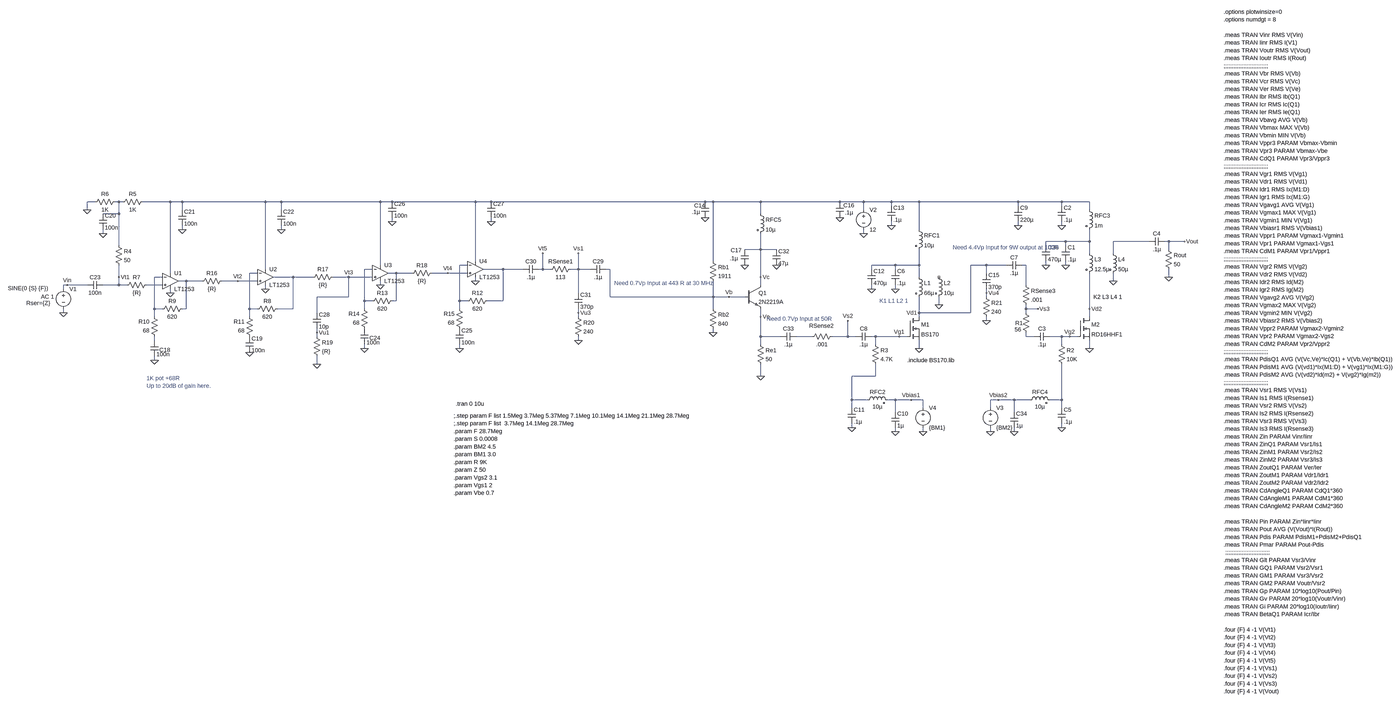
[diagram p0: schematic LT1253 2N2219 CC BS170 RD16HHF Power Amp Testing.asc, whole sheet]
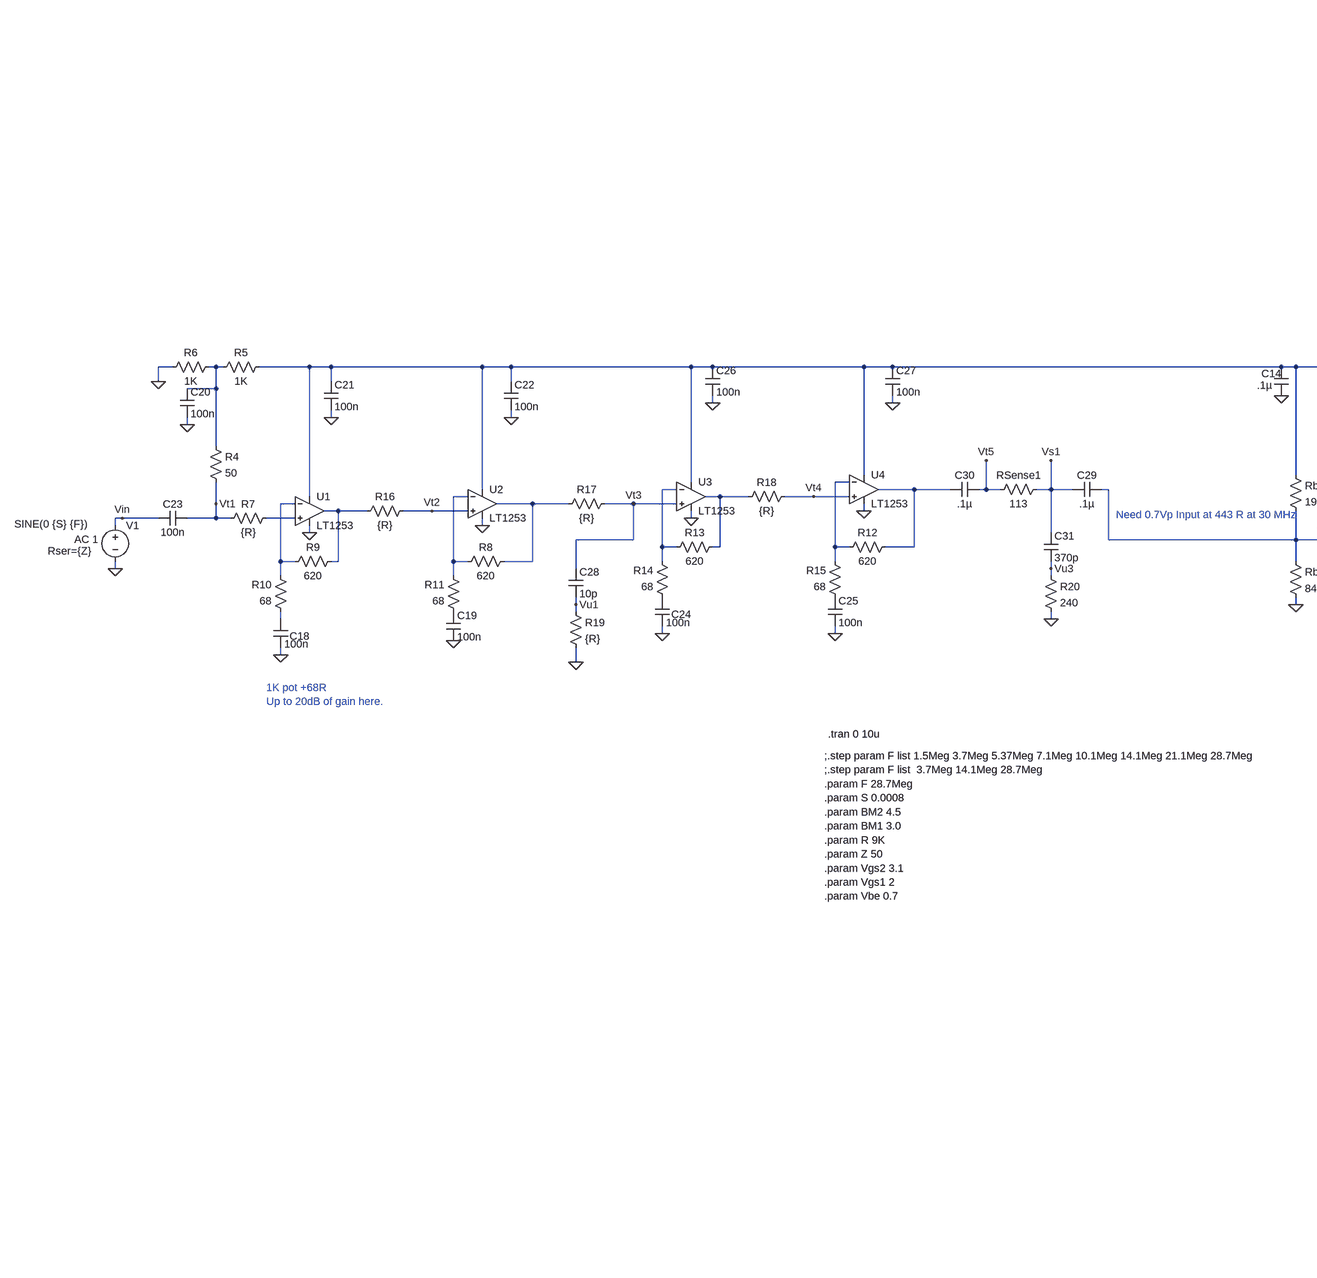
[diagram p1: schematic LT1253 2N2219 CC BS170 RD16HHF Power Amp Testing.asc, part, row 1 of 1, column 1 of 2]
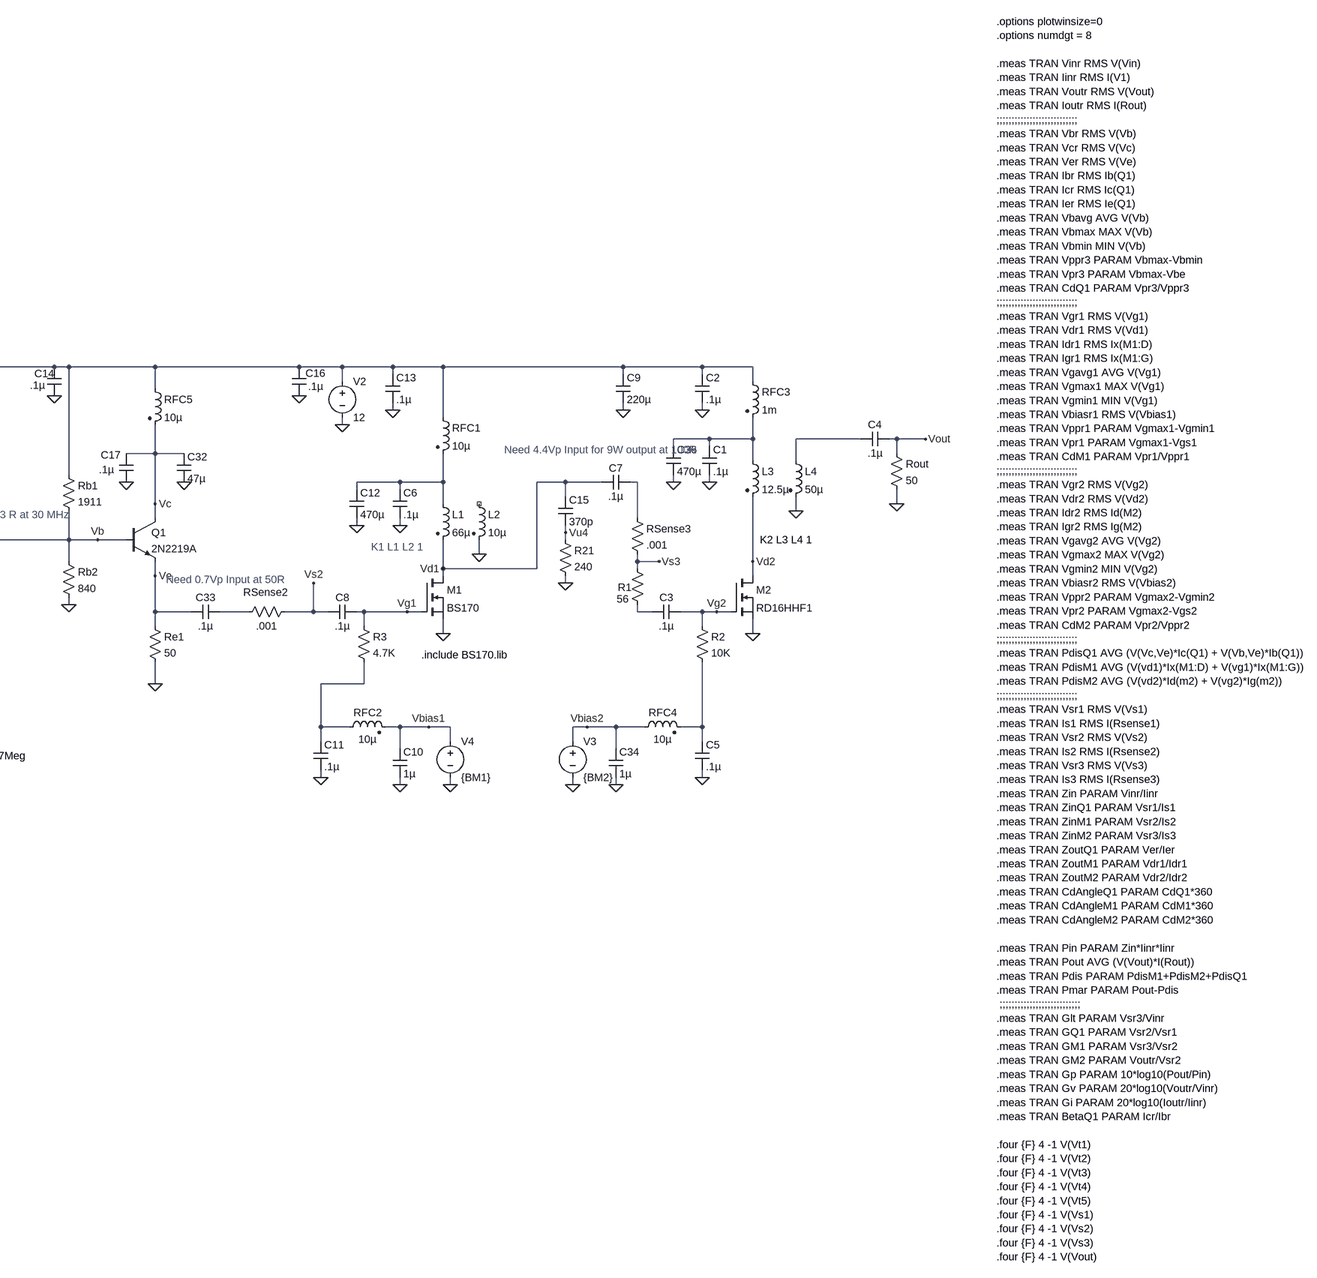
[diagram p2: schematic LT1253 2N2219 CC BS170 RD16HHF Power Amp Testing.asc, part, row 1 of 1, column 2 of 2]
LT1253 2N2219 CC BS170 RD16HHF Power Amp Testing.asc, the LTspice schematic file:
Version 4
SHEET 1 3136 1620
WIRE -2864 -176 -2896 -176
WIRE -2768 -176 -2784 -176
WIRE -2752 -176 -2768 -176
WIRE -2560 -176 -2672 -176
WIRE -2512 -176 -2560 -176
WIRE -2176 -176 -2512 -176
WIRE -2112 -176 -2176 -176
WIRE -1712 -176 -2112 -176
WIRE -1664 -176 -1712 -176
WIRE -1328 -176 -1664 -176
WIRE -1264 -176 -1328 -176
WIRE -400 -176 -1264 -176
WIRE -368 -176 -400 -176
WIRE -176 -176 -368 -176
WIRE 144 -176 -176 -176
WIRE 240 -176 144 -176
WIRE 352 -176 240 -176
WIRE 464 -176 352 -176
WIRE 864 -176 464 -176
WIRE 1040 -176 864 -176
WIRE 1152 -176 1040 -176
WIRE 352 -160 352 -176
WIRE 864 -160 864 -176
WIRE 1040 -160 1040 -176
WIRE -2896 -144 -2896 -176
WIRE -2512 -144 -2512 -176
WIRE -2112 -144 -2112 -176
WIRE 240 -144 240 -176
WIRE 1152 -144 1152 -176
WIRE -2768 -128 -2768 -176
WIRE -2768 -128 -2832 -128
WIRE -176 -128 -176 -176
WIRE -1664 -96 -1664 -112
WIRE -1264 -96 -1264 -112
WIRE 352 -80 352 -96
WIRE 864 -80 864 -96
WIRE 1040 -80 1040 -96
WIRE -2512 -64 -2512 -80
WIRE -2112 -64 -2112 -80
WIRE 464 -64 464 -176
WIRE -2832 -48 -2832 -64
WIRE 240 -48 240 -64
WIRE 1056 -16 976 -16
WIRE 1152 -16 1152 -64
WIRE 1152 -16 1056 -16
WIRE 1392 -16 1248 -16
WIRE 1472 -16 1456 -16
WIRE 1536 -16 1472 -16
WIRE -2768 0 -2768 -128
WIRE 976 0 976 -16
WIRE 1056 0 1056 -16
WIRE -176 16 -176 -48
WIRE -176 16 -240 16
WIRE -112 16 -176 16
WIRE 1472 16 1472 -16
WIRE 1152 32 1152 -16
WIRE 1248 32 1248 -16
WIRE -1328 64 -1328 -176
WIRE -368 64 -368 -176
WIRE -1712 80 -1712 -176
WIRE -1360 80 -1392 80
WIRE 368 80 272 80
WIRE 464 80 464 16
WIRE 464 80 368 80
WIRE 736 80 672 80
WIRE 816 80 736 80
WIRE 896 80 880 80
WIRE 976 80 976 64
WIRE 1056 80 1056 64
WIRE -2176 96 -2176 -176
WIRE -1744 96 -1776 96
WIRE -1216 96 -1296 96
WIRE -1136 96 -1216 96
WIRE -1056 96 -1056 32
WIRE -1056 96 -1072 96
WIRE -1024 96 -1056 96
WIRE -912 96 -912 32
WIRE -912 96 -944 96
WIRE -864 96 -912 96
WIRE -784 96 -800 96
WIRE 272 96 272 80
WIRE 368 96 368 80
WIRE -2560 112 -2560 -176
WIRE -2208 112 -2240 112
WIRE -1648 112 -1680 112
WIRE -1584 112 -1648 112
WIRE -1440 112 -1504 112
WIRE -1360 112 -1440 112
WIRE 736 112 736 80
WIRE -2768 128 -2768 80
WIRE -2592 128 -2624 128
WIRE -2064 128 -2144 128
WIRE -1984 128 -2064 128
WIRE -1840 128 -1904 128
WIRE -1744 128 -1840 128
WIRE -176 128 -176 16
WIRE 464 128 464 80
WIRE 1472 128 1472 96
WIRE -2496 144 -2528 144
WIRE -2432 144 -2496 144
WIRE -2288 144 -2352 144
WIRE -2208 144 -2288 144
WIRE -1328 144 -1328 128
WIRE 1248 144 1248 112
WIRE -2976 160 -2992 160
WIRE -2896 160 -2976 160
WIRE -2768 160 -2768 128
WIRE -2768 160 -2832 160
WIRE -2736 160 -2768 160
WIRE -2592 160 -2656 160
WIRE -1712 160 -1712 144
WIRE -176 160 -176 128
WIRE 896 160 896 80
WIRE -2992 176 -2992 160
WIRE -2176 176 -2176 160
WIRE 272 176 272 160
WIRE 368 176 368 160
WIRE -2560 192 -2560 176
WIRE -912 192 -912 96
WIRE 736 192 736 176
WIRE -1840 208 -1840 128
WIRE -1840 208 -1968 208
WIRE -784 208 -784 96
WIRE -368 208 -368 144
WIRE -368 208 -784 208
WIRE -304 208 -368 208
WIRE -240 208 -304 208
WIRE 736 208 736 192
WIRE -1776 224 -1776 96
WIRE -1744 224 -1776 224
WIRE -1648 224 -1648 112
WIRE -1648 224 -1664 224
WIRE -1392 224 -1392 80
WIRE -1360 224 -1392 224
WIRE -1216 224 -1216 96
WIRE -1216 224 -1280 224
WIRE 544 240 544 208
WIRE -2624 256 -2624 128
WIRE -2592 256 -2624 256
WIRE -2496 256 -2496 144
WIRE -2496 256 -2512 256
WIRE -2240 256 -2240 112
WIRE -2208 256 -2240 256
WIRE -2064 256 -2064 128
WIRE -2064 256 -2128 256
WIRE -1776 256 -1776 224
WIRE -1392 256 -1392 224
WIRE -368 256 -368 208
WIRE 896 256 896 240
WIRE 944 256 896 256
WIRE 1152 256 1152 112
WIRE -2992 272 -2992 256
WIRE -1968 272 -1968 208
WIRE -912 272 -912 256
WIRE 464 272 464 208
WIRE 672 272 672 80
WIRE 672 272 464 272
WIRE 896 272 896 256
WIRE -2624 288 -2624 256
WIRE -2240 288 -2240 256
WIRE -912 288 -912 272
WIRE -176 288 -176 256
WIRE 464 288 464 272
WIRE 1152 288 1152 256
WIRE 736 304 736 288
WIRE -1968 352 -1968 336
WIRE -368 352 -368 336
WIRE -1968 368 -1968 352
WIRE -176 368 -176 288
WIRE -96 368 -176 368
WIRE 32 368 -32 368
WIRE 176 368 176 304
WIRE 176 368 112 368
WIRE 208 368 176 368
WIRE 288 368 272 368
WIRE 384 368 288 368
WIRE 416 368 384 368
WIRE 896 368 896 352
WIRE 928 368 896 368
WIRE 1040 368 992 368
WIRE 1072 368 1040 368
WIRE 1104 368 1072 368
WIRE -2624 384 -2624 368
WIRE -912 384 -912 368
WIRE -176 400 -176 368
WIRE 288 400 288 368
WIRE 1040 400 1040 368
WIRE -1776 416 -1776 400
WIRE -1392 416 -1392 400
WIRE 464 416 464 384
WIRE 1152 416 1152 384
WIRE -2624 464 -2624 448
WIRE -1968 480 -1968 448
WIRE -176 528 -176 480
WIRE 288 528 288 480
WIRE 288 528 192 528
WIRE 192 624 192 528
WIRE 256 624 192 624
WIRE 368 624 336 624
WIRE 432 624 368 624
WIRE 480 624 432 624
WIRE 784 624 752 624
WIRE 848 624 784 624
WIRE 912 624 848 624
WIRE 1040 624 1040 480
WIRE 1040 624 992 624
WIRE 192 656 192 624
WIRE 480 656 480 624
WIRE 752 656 752 624
WIRE 1040 656 1040 624
WIRE 368 672 368 624
WIRE 848 672 848 624
WIRE 192 736 192 720
WIRE 1040 736 1040 720
WIRE 368 752 368 736
WIRE 480 752 480 736
WIRE 752 752 752 736
WIRE 848 752 848 736
FLAG 240 -48 0
FLAG 1472 128 0
FLAG 1536 -16 Vout
FLAG -2992 272 0
FLAG -2976 160 Vin
FLAG 464 416 0
FLAG 384 368 Vg1
FLAG 464 272 Vd1
FLAG 368 176 0
FLAG 368 752 0
FLAG 192 736 0
FLAG 480 752 0
FLAG 432 624 Vbias1
FLAG 352 -80 0
FLAG 544 240 0
FLAG 1152 416 0
FLAG 1072 368 Vg2
FLAG 1152 256 Vd2
FLAG 1056 80 0
FLAG 1040 -80 0
FLAG 1248 144 0
FLAG 1040 736 0
FLAG 944 256 Vs3
FLAG 752 752 0
FLAG 784 624 Vbias2
FLAG 144 -112 0
FLAG 176 304 Vs2
FLAG 864 -80 0
FLAG 976 80 0
FLAG 272 176 0
FLAG -368 352 0
FLAG -176 528 0
FLAG -304 208 Vb
FLAG -176 288 Ve
FLAG -176 128 Vc
FLAG -400 -112 0
FLAG -240 80 0
FLAG -2512 -64 0
FLAG -2832 -48 0
FLAG -2560 192 0
FLAG -2176 176 0
FLAG -2240 432 0
FLAG -2112 -64 0
FLAG -2896 -144 0
FLAG -2624 464 0
FLAG -1664 -96 0
FLAG -1712 160 0
FLAG -1328 144 0
FLAG -1392 416 0
FLAG -1264 -96 0
FLAG -1776 416 0
FLAG -1968 352 Vu1
FLAG -1968 480 0
FLAG -912 32 Vs1
FLAG -2768 128 Vt1
FLAG -2288 144 Vt2
FLAG -1840 128 Vt3
FLAG -1056 32 Vt5
FLAG -1440 112 Vt4
FLAG -912 272 Vu3
FLAG -912 384 0
FLAG -112 80 0
FLAG 736 192 Vu4
FLAG 736 304 0
FLAG 848 752 0
SYMBOL voltage 240 -160 R0
WINDOW 123 0 0 Left 2
WINDOW 39 0 0 Left 2
SYMATTR InstName V2
SYMATTR Value 12
SYMBOL res 1456 0 R0
SYMATTR InstName Rout
SYMATTR Value 50
SYMBOL voltage -2992 160 R0
WINDOW 123 -91 47 Left 2
WINDOW 39 -150 73 Left 2
WINDOW 3 -224 13 Left 2
SYMATTR Value2 AC 1
SYMATTR SpiceLine Rser={Z}
SYMATTR Value SINE(0 {S} {F})
SYMATTR InstName V1
SYMBOL ind2 448 112 R0
SYMATTR InstName L1
SYMATTR Value 66µ
SYMATTR Type ind
SYMBOL res 272 384 R0
SYMATTR InstName R3
SYMATTR Value 4.7K
SYMBOL cap 352 96 R0
SYMATTR InstName C6
SYMATTR Value .1µ
SYMBOL cap 1392 0 R270
WINDOW 0 32 32 VTop 2
WINDOW 3 0 32 VBottom 2
SYMATTR InstName C4
SYMATTR Value .1µ
SYMBOL ind2 240 640 R270
WINDOW 0 32 56 VTop 2
WINDOW 3 4 56 VBottom 2
SYMATTR InstName RFC2
SYMATTR Value 10µ
SYMATTR Type ind
SYMBOL cap 352 672 R0
SYMATTR InstName C10
SYMATTR Value 1µ
SYMBOL cap 176 656 R0
SYMATTR InstName C11
SYMATTR Value .1µ
SYMBOL voltage 480 640 R0
WINDOW 123 0 0 Left 2
WINDOW 39 0 0 Left 2
SYMATTR InstName V4
SYMATTR Value {BM1}
SYMBOL ind2 528 112 R0
SYMATTR InstName L2
SYMATTR Value 10µ
SYMATTR Type ind
SYMBOL cap 336 -160 R0
SYMATTR InstName C13
SYMATTR Value .1µ
SYMBOL nmos 1104 288 R0
SYMATTR InstName M2
SYMATTR Value RD16HHF1
SYMBOL ind2 1136 16 R0
SYMATTR InstName L3
SYMATTR Value 12.5µ
SYMATTR Type ind
SYMBOL ind2 1136 -160 R0
SYMATTR InstName RFC3
SYMATTR Value 1m
SYMATTR Type ind
SYMBOL cap 1040 0 R0
SYMATTR InstName C1
SYMATTR Value .1µ
SYMBOL ind2 1232 16 R0
SYMATTR InstName L4
SYMATTR Value 50µ
SYMATTR Type ind
SYMBOL cap 1024 -160 R0
SYMATTR InstName C2
SYMATTR Value .1µ
SYMBOL res 880 144 R0
SYMATTR InstName RSense3
SYMATTR Value .001
SYMBOL cap 992 352 R90
WINDOW 0 0 32 VBottom 2
WINDOW 3 32 32 VTop 2
SYMATTR InstName C3
SYMATTR Value .1µ
SYMBOL res 1024 384 R0
SYMATTR InstName R2
SYMATTR Value 10K
SYMBOL ind2 896 640 R270
WINDOW 0 32 56 VTop 2
WINDOW 3 4 56 VBottom 2
SYMATTR InstName RFC4
SYMATTR Value 10µ
SYMATTR Type ind
SYMBOL cap 1024 656 R0
SYMATTR InstName C5
SYMATTR Value .1µ
SYMBOL cap 816 96 R270
WINDOW 0 32 32 VTop 2
WINDOW 3 0 32 VBottom 2
SYMATTR InstName C7
SYMATTR Value .1µ
SYMBOL voltage 752 640 R0
WINDOW 123 0 0 Left 2
WINDOW 39 0 0 Left 2
SYMATTR InstName V3
SYMATTR Value {BM2}
SYMBOL cap 128 -176 R0
WINDOW 0 30 14 Left 2
WINDOW 3 36 43 Left 2
SYMATTR InstName C16
SYMATTR Value .1µ
SYMBOL res 128 352 R90
WINDOW 0 -12 59 VBottom 2
WINDOW 3 32 56 VTop 2
SYMATTR InstName RSense2
SYMATTR Value .001
SYMBOL cap 848 -160 R0
SYMATTR InstName C9
SYMATTR Value 220µ
SYMBOL cap 960 0 R0
SYMATTR InstName C36
SYMATTR Value 470µ
SYMBOL res 880 256 R0
WINDOW 0 -28 58 Left 2
WINDOW 3 -30 84 Left 2
SYMATTR InstName R1
SYMATTR Value 56
SYMBOL cap 208 384 R270
WINDOW 0 32 32 VTop 2
WINDOW 3 0 32 VBottom 2
SYMATTR InstName C8
SYMATTR Value .1µ
SYMBOL nmos 416 288 R0
SYMATTR InstName M1
SYMATTR Value BS170
SYMATTR Prefix X
SYMBOL ind2 448 -80 R0
SYMATTR InstName RFC1
SYMATTR Value 10µ
SYMATTR Type ind
SYMBOL cap 256 96 R0
SYMATTR InstName C12
SYMATTR Value 470µ
SYMBOL res -384 48 R0
SYMATTR InstName Rb1
SYMATTR Value 1911
SYMBOL res -384 240 R0
SYMATTR InstName Rb2
SYMATTR Value 840
SYMBOL res -192 384 R0
SYMATTR InstName Re1
SYMATTR Value 50
SYMBOL npn -240 160 R0
SYMATTR InstName Q1
SYMATTR Value 2N2219A
SYMBOL cap -416 -176 R0
WINDOW 0 -28 15 Left 2
WINDOW 3 -38 41 Left 2
SYMATTR InstName C14
SYMATTR Value .1µ
SYMBOL cap -256 16 R0
WINDOW 0 -41 4 Left 2
WINDOW 3 -45 36 Left 2
SYMATTR InstName C17
SYMATTR Value .1µ
SYMBOL Opamps\\LT1253 -2560 80 R0
SYMATTR InstName U1
SYMBOL Opamps\\LT1253 -2176 64 R0
SYMATTR InstName U2
SYMBOL res -2784 -16 R0
SYMATTR InstName R4
SYMATTR Value 50
SYMBOL res -2656 -192 R90
WINDOW 0 0 56 VBottom 2
WINDOW 3 32 56 VTop 2
SYMATTR InstName R5
SYMATTR Value 1K
SYMBOL res -2768 -192 R90
WINDOW 0 0 56 VBottom 2
WINDOW 3 32 56 VTop 2
SYMATTR InstName R6
SYMATTR Value 1K
SYMBOL res -2640 144 R90
WINDOW 0 0 56 VBottom 2
WINDOW 3 32 56 VTop 2
SYMATTR InstName R7
SYMATTR Value {R}
SYMBOL res -2112 240 R90
WINDOW 0 0 56 VBottom 2
WINDOW 3 32 56 VTop 2
SYMATTR InstName R8
SYMATTR Value 620
SYMBOL res -2496 240 R90
WINDOW 0 0 56 VBottom 2
WINDOW 3 32 56 VTop 2
SYMATTR InstName R9
SYMATTR Value 620
SYMBOL res -2608 384 R180
WINDOW 0 36 76 Left 2
WINDOW 3 36 40 Left 2
SYMATTR InstName R10
SYMATTR Value 68
SYMBOL res -2224 384 R180
WINDOW 0 36 76 Left 2
WINDOW 3 36 40 Left 2
SYMATTR InstName R11
SYMATTR Value 68
SYMBOL cap -2640 384 R0
WINDOW 0 36 38 Left 2
SYMATTR InstName C18
SYMATTR Value 100n
SYMBOL cap -2256 368 R0
SYMATTR InstName C19
SYMATTR Value 100n
SYMBOL cap -2848 -128 R0
SYMATTR InstName C20
SYMATTR Value 100n
SYMBOL cap -2528 -144 R0
SYMATTR InstName C21
SYMATTR Value 100n
SYMBOL cap -2128 -144 R0
SYMATTR InstName C22
SYMATTR Value 100n
SYMBOL cap -2832 144 R90
WINDOW 0 0 32 VBottom 2
WINDOW 3 32 32 VTop 2
SYMATTR InstName C23
SYMATTR Value 100n
SYMBOL Opamps\\LT1253 -1712 48 R0
SYMATTR InstName U3
SYMBOL Opamps\\LT1253 -1328 32 R0
SYMATTR InstName U4
SYMBOL res -1264 208 R90
WINDOW 0 0 56 VBottom 2
WINDOW 3 32 56 VTop 2
SYMATTR InstName R12
SYMATTR Value 620
SYMBOL res -1648 208 R90
WINDOW 0 0 56 VBottom 2
WINDOW 3 32 56 VTop 2
SYMATTR InstName R13
SYMATTR Value 620
SYMBOL res -1760 352 R180
WINDOW 0 36 76 Left 2
WINDOW 3 36 40 Left 2
SYMATTR InstName R14
SYMATTR Value 68
SYMBOL res -1376 352 R180
WINDOW 0 36 76 Left 2
WINDOW 3 36 40 Left 2
SYMATTR InstName R15
SYMATTR Value 68
SYMBOL cap -1792 336 R0
WINDOW 0 36 38 Left 2
SYMATTR InstName C24
SYMATTR Value 100n
SYMBOL cap -1408 336 R0
SYMATTR InstName C25
SYMATTR Value 100n
SYMBOL cap -1680 -176 R0
SYMATTR InstName C26
SYMATTR Value 100n
SYMBOL cap -1280 -176 R0
SYMATTR InstName C27
SYMATTR Value 100n
SYMBOL res -2336 128 R90
WINDOW 0 0 56 VBottom 2
WINDOW 3 32 56 VTop 2
SYMATTR InstName R16
SYMATTR Value {R}
SYMBOL res -1888 112 R90
WINDOW 0 0 56 VBottom 2
WINDOW 3 32 56 VTop 2
SYMATTR InstName R17
SYMATTR Value {R}
SYMBOL res -1488 96 R90
WINDOW 0 0 56 VBottom 2
WINDOW 3 32 56 VTop 2
SYMATTR InstName R18
SYMATTR Value {R}
SYMBOL cap -1984 272 R0
SYMATTR InstName C28
SYMATTR Value 10p
SYMBOL res -1984 352 R0
SYMATTR InstName R19
SYMATTR Value {R}
SYMBOL cap -864 112 R270
WINDOW 0 32 32 VTop 2
WINDOW 3 0 32 VBottom 2
SYMATTR InstName C29
SYMATTR Value .1µ
SYMBOL cap -1136 112 R270
WINDOW 0 32 32 VTop 2
WINDOW 3 0 32 VBottom 2
SYMATTR InstName C30
SYMATTR Value .1µ
SYMBOL res -928 80 R90
WINDOW 0 0 56 VBottom 2
WINDOW 3 32 56 VTop 2
SYMATTR InstName RSense1
SYMATTR Value 113
SYMBOL cap -928 192 R0
SYMATTR InstName C31
SYMATTR Value 370p
SYMBOL res -928 272 R0
SYMATTR InstName R20
SYMATTR Value 240
SYMBOL ind2 -192 -144 R0
SYMATTR InstName RFC5
SYMATTR Value 10µ
SYMATTR Type ind
SYMBOL cap -128 16 R0
SYMATTR InstName C32
SYMATTR Value 47µ
SYMBOL cap -96 384 R270
WINDOW 0 32 32 VTop 2
WINDOW 3 0 32 VBottom 2
SYMATTR InstName C33
SYMATTR Value .1µ
SYMBOL cap 720 112 R0
SYMATTR InstName C15
SYMATTR Value 370p
SYMBOL res 720 192 R0
SYMATTR InstName R21
SYMATTR Value 240
SYMBOL cap 832 672 R0
SYMATTR InstName C34
SYMATTR Value 1µ
TEXT -1408 640 Left 2 !.tran 0 10u
TEXT 1712 -944 Left 2 !.options plotwinsize=0\n.options numdgt = 8\n \n.meas TRAN Vinr RMS V(Vin)\n.meas TRAN Iinr RMS I(V1)\n.meas TRAN Voutr RMS V(Vout)\n.meas TRAN Ioutr RMS I(Rout)\n;;;;;;;;;;;;;;;;;;;;;;;;;;;\n.meas TRAN Vbr RMS V(Vb)\n.meas TRAN Vcr RMS V(Vc)\n.meas TRAN Ver RMS V(Ve)\n.meas TRAN Ibr RMS Ib(Q1)\n.meas TRAN Icr RMS Ic(Q1)\n.meas TRAN Ier RMS Ie(Q1)\n.meas TRAN Vbavg AVG V(Vb)\n.meas TRAN Vbmax MAX V(Vb)\n.meas TRAN Vbmin MIN V(Vb)\n.meas TRAN Vppr3 PARAM Vbmax-Vbmin\n.meas TRAN Vpr3 PARAM Vbmax-Vbe\n.meas TRAN CdQ1 PARAM Vpr3/Vppr3\n;;;;;;;;;;;;;;;;;;;;;;;;;;;\n.meas TRAN Vgr1 RMS V(Vg1)\n.meas TRAN Vdr1 RMS V(Vd1)\n.meas TRAN Idr1 RMS Ix(M1:D)\n.meas TRAN Igr1 RMS Ix(M1:G)\n.meas TRAN Vgavg1 AVG V(Vg1)\n.meas TRAN Vgmax1 MAX V(Vg1)\n.meas TRAN Vgmin1 MIN V(Vg1)\n.meas TRAN Vbiasr1 RMS V(Vbias1)\n.meas TRAN Vppr1 PARAM Vgmax1-Vgmin1\n.meas TRAN Vpr1 PARAM Vgmax1-Vgs1\n.meas TRAN CdM1 PARAM Vpr1/Vppr1\n;;;;;;;;;;;;;;;;;;;;;;;;;;;\n.meas TRAN Vgr2 RMS V(Vg2)\n.meas TRAN Vdr2 RMS V(Vd2)\n.meas TRAN Idr2 RMS Id(M2)\n.meas TRAN Igr2 RMS Ig(M2)\n.meas TRAN Vgavg2 AVG V(Vg2)\n.meas TRAN Vgmax2 MAX V(Vg2)\n.meas TRAN Vgmin2 MIN V(Vg2)\n.meas TRAN Vbiasr2 RMS V(Vbias2)\n.meas TRAN Vppr2 PARAM Vgmax2-Vgmin2\n.meas TRAN Vpr2 PARAM Vgmax2-Vgs2\n.meas TRAN CdM2 PARAM Vpr2/Vppr2\n;;;;;;;;;;;;;;;;;;;;;;;;;;;\n.meas TRAN PdisQ1 AVG (V(Vc,Ve)*Ic(Q1) + V(Vb,Ve)*Ib(Q1))\n.meas TRAN PdisM1 AVG (V(vd1)*Ix(M1:D) + V(vg1)*Ix(M1:G))\n.meas TRAN PdisM2 AVG (V(vd2)*Id(m2) + V(vg2)*Ig(m2))\n;;;;;;;;;;;;;;;;;;;;;;;;;;;\n.meas TRAN Vsr1 RMS V(Vs1)\n.meas TRAN Is1 RMS I(Rsense1)\n.meas TRAN Vsr2 RMS V(Vs2)\n.meas TRAN Is2 RMS I(Rsense2)\n.meas TRAN Vsr3 RMS V(Vs3)\n.meas TRAN Is3 RMS I(Rsense3)\n.meas TRAN Zin PARAM Vinr/Iinr\n.meas TRAN ZinQ1 PARAM Vsr1/Is1\n.meas TRAN ZinM1 PARAM Vsr2/Is2\n.meas TRAN ZinM2 PARAM Vsr3/Is3\n.meas TRAN ZoutQ1 PARAM Ver/Ier\n.meas TRAN ZoutM1 PARAM Vdr1/Idr1\n.meas TRAN ZoutM2 PARAM Vdr2/Idr2\n.meas TRAN CdAngleQ1 PARAM CdQ1*360\n.meas TRAN CdAngleM1 PARAM CdM1*360\n.meas TRAN CdAngleM2 PARAM CdM2*360\n \n.meas TRAN Pin PARAM Zin*Iinr*Iinr\n.meas TRAN Pout AVG (V(Vout)*I(Rout))\n.meas TRAN Pdis PARAM PdisM1+PdisM2+PdisQ1\n.meas TRAN Pmar PARAM Pout-Pdis\n ;;;;;;;;;;;;;;;;;;;;;;;;;;;\n.meas TRAN Glt PARAM Vsr3/Vinr\n.meas TRAN GQ1 PARAM Vsr2/Vsr1\n.meas TRAN GM1 PARAM Vsr3/Vsr2\n.meas TRAN GM2 PARAM Voutr/Vsr2\n.meas TRAN Gp PARAM 10*log10(Pout/Pin)\n.meas TRAN Gv PARAM 20*log10(Voutr/Vinr)\n.meas TRAN Gi PARAM 20*log10(Ioutr/Iinr)\n.meas TRAN BetaQ1 PARAM Icr/Ibr\n \n.four {F} 4 -1 V(Vt1)\n.four {F} 4 -1 V(Vt2)\n.four {F} 4 -1 V(Vt3)\n.four {F} 4 -1 V(Vt4)\n.four {F} 4 -1 V(Vt5)\n.four {F} 4 -1 V(Vs1)\n.four {F} 4 -1 V(Vs2)\n.four {F} 4 -1 V(Vs3)\n.four {F} 4 -1 V(Vout)
TEXT -1416 688 Left 2 !;.step param F list 1.5Meg 3.7Meg 5.37Meg 7.1Meg 10.1Meg 14.1Meg 21.1Meg 28.7Meg\n;.step param F list  3.7Meg 14.1Meg 28.7Meg\n.param F 28.7Meg\n.param S 0.0008\n.param BM2 4.5\n.param BM1 3.0\n.param R 9K\n.param Z 50\n.param Vgs2 3.1\n.param Vgs1 2\n.param Vbe 0.7
TEXT 304 224 Left 2 ;K1 L1 L2 1
TEXT 1168 208 Left 2 !K2 L3 L4 1
TEXT 600 8 Left 2 ;Need 4.4Vp Input for 9W output at 100R
TEXT 416 464 Left 2 !.include BS170.lib
TEXT -768 152 Left 2 ;Need 0.7Vp Input at 443 R at 30 MHz
TEXT -152 296 Left 2 ;Need 0.7Vp Input at 50R
TEXT -2656 536 Left 2 ;1K pot +68R  \nUp to 20dB of gain here.

The netlist it stands for:
* LT1253 2N2219 CC BS170 RD16HHF Power Amp Testing.asc
V2 N002 0 12
Rout Vout 0 50
V1 Vin 0 SINE(0 {S} {F}) AC 1 Rser={Z}
L1 N006 Vd1 66µ
R3 Vg1 N019 4.7K
C6 N006 0 .1µ
C4 N004 Vout .1µ
L§RFC2 N019 Vbias1 10µ
C10 Vbias1 0 1µ
C11 N019 0 .1µ
V4 Vbias1 0 {BM1}
L2 NC_01 0 10µ
C13 N002 0 .1µ
M2 Vd2 Vg2 0 0 RD16HHF1
L3 N003 Vd2 12.5µ
L§RFC3 N002 N003 1m
C1 N003 0 .1µ
L4 N004 0 50µ
C2 N002 0 .1µ
RSense3 N007 Vs3 .001
C3 Vg2 N017 .1µ
R2 Vg2 N020 10K
L§RFC4 Vbias2 N020 10µ
C5 N020 0 .1µ
C7 Vd1 N007 .1µ
V3 Vbias2 0 {BM2}
C16 N002 0 .1µ
RSense2 Vs2 N016 .001
C9 N002 0 220µ
C36 N003 0 470µ
R1 Vs3 N017 56
C8 Vs2 Vg1 .1µ
XM1 Vd1 Vg1 0 BS170  ; pins D G S
L§RFC1 N002 N006 10µ
C12 N006 0 470µ
Rb1 N002 Vb 1911
Rb2 Vb 0 840
Re1 Ve 0 50
Q1 Vc Vb Ve 0 2N2219A
C14 N002 0 .1µ
C17 Vc 0 .1µ
XU1 N015 N012 N002 0 N014 LT1253  ; pins In+ In- V+ V- OUT
XU2 Vt2 N010 N002 0 N013 LT1253  ; pins In+ In- V+ V- OUT
R4 N001 Vt1 50
R5 N002 N001 1K
R6 N001 0 1K
R7 N015 Vt1 {R}
R8 N013 N010 620
R9 N014 N012 620
R10 N018 N012 68
R11 P001 N010 68
C18 N018 0 100n
C19 P001 0 100n
C20 N001 0 100n
C21 N002 0 100n
C22 N002 0 100n
C23 Vt1 Vin 100n
XU3 Vt3 N008 N002 0 N011 LT1253  ; pins In+ In- V+ V- OUT
XU4 Vt4 N005 N002 0 N009 LT1253  ; pins In+ In- V+ V- OUT
R12 N009 N005 620
R13 N011 N008 620
R14 P002 N008 68
R15 P003 N005 68
C24 P002 0 100n
C25 P003 0 100n
C26 N002 0 100n
C27 N002 0 100n
R16 Vt2 N014 {R}
R17 Vt3 N013 {R}
R18 Vt4 N011 {R}
C28 Vt3 Vu1 10p
R19 Vu1 0 {R}
C29 Vs1 Vb .1µ
C30 N009 Vt5 .1µ
RSense1 Vs1 Vt5 113
C31 Vs1 Vu3 370p
R20 Vu3 0 240
L§RFC5 N002 Vc 10µ
C32 Vc 0 47µ
C33 Ve N016 .1µ
C15 Vd1 Vu4 370p
R21 Vu4 0 240
C34 Vbias2 0 1µ
.model NPN NPN
.model PNP PNP
.lib standard.bjt
.model NMOS NMOS
.model PMOS PMOS
.lib standard.mos
.tran 0 10u
.options plotwinsize=0
.options numdgt = 8
.meas TRAN Vinr RMS V(Vin)
.meas TRAN Iinr RMS I(V1)
.meas TRAN Voutr RMS V(Vout)
.meas TRAN Ioutr RMS I(Rout)
;;;;;;;;;;;;;;;;;;;;;;;;;;;
.meas TRAN Vbr RMS V(Vb)
.meas TRAN Vcr RMS V(Vc)
.meas TRAN Ver RMS V(Ve)
.meas TRAN Ibr RMS Ib(Q1)
.meas TRAN Icr RMS Ic(Q1)
.meas TRAN Ier RMS Ie(Q1)
.meas TRAN Vbavg AVG V(Vb)
.meas TRAN Vbmax MAX V(Vb)
.meas TRAN Vbmin MIN V(Vb)
.meas TRAN Vppr3 PARAM Vbmax-Vbmin
.meas TRAN Vpr3 PARAM Vbmax-Vbe
.meas TRAN CdQ1 PARAM Vpr3/Vppr3
;;;;;;;;;;;;;;;;;;;;;;;;;;;
.meas TRAN Vgr1 RMS V(Vg1)
.meas TRAN Vdr1 RMS V(Vd1)
.meas TRAN Idr1 RMS Ix(M1:D)
.meas TRAN Igr1 RMS Ix(M1:G)
.meas TRAN Vgavg1 AVG V(Vg1)
.meas TRAN Vgmax1 MAX V(Vg1)
.meas TRAN Vgmin1 MIN V(Vg1)
.meas TRAN Vbiasr1 RMS V(Vbias1)
.meas TRAN Vppr1 PARAM Vgmax1-Vgmin1
.meas TRAN Vpr1 PARAM Vgmax1-Vgs1
.meas TRAN CdM1 PARAM Vpr1/Vppr1
;;;;;;;;;;;;;;;;;;;;;;;;;;;
.meas TRAN Vgr2 RMS V(Vg2)
.meas TRAN Vdr2 RMS V(Vd2)
.meas TRAN Idr2 RMS Id(M2)
.meas TRAN Igr2 RMS Ig(M2)
.meas TRAN Vgavg2 AVG V(Vg2)
.meas TRAN Vgmax2 MAX V(Vg2)
.meas TRAN Vgmin2 MIN V(Vg2)
.meas TRAN Vbiasr2 RMS V(Vbias2)
.meas TRAN Vppr2 PARAM Vgmax2-Vgmin2
.meas TRAN Vpr2 PARAM Vgmax2-Vgs2
.meas TRAN CdM2 PARAM Vpr2/Vppr2
;;;;;;;;;;;;;;;;;;;;;;;;;;;
.meas TRAN PdisQ1 AVG (V(Vc,Ve)*Ic(Q1) + V(Vb,Ve)*Ib(Q1))
.meas TRAN PdisM1 AVG (V(vd1)*Ix(M1:D) + V(vg1)*Ix(M1:G))
.meas TRAN PdisM2 AVG (V(vd2)*Id(m2) + V(vg2)*Ig(m2))
;;;;;;;;;;;;;;;;;;;;;;;;;;;
.meas TRAN Vsr1 RMS V(Vs1)
.meas TRAN Is1 RMS I(Rsense1)
.meas TRAN Vsr2 RMS V(Vs2)
.meas TRAN Is2 RMS I(Rsense2)
.meas TRAN Vsr3 RMS V(Vs3)
.meas TRAN Is3 RMS I(Rsense3)
.meas TRAN Zin PARAM Vinr/Iinr
.meas TRAN ZinQ1 PARAM Vsr1/Is1
.meas TRAN ZinM1 PARAM Vsr2/Is2
.meas TRAN ZinM2 PARAM Vsr3/Is3
.meas TRAN ZoutQ1 PARAM Ver/Ier
.meas TRAN ZoutM1 PARAM Vdr1/Idr1
.meas TRAN ZoutM2 PARAM Vdr2/Idr2
.meas TRAN CdAngleQ1 PARAM CdQ1*360
.meas TRAN CdAngleM1 PARAM CdM1*360
.meas TRAN CdAngleM2 PARAM CdM2*360
.meas TRAN Pin PARAM Zin*Iinr*Iinr
.meas TRAN Pout AVG (V(Vout)*I(Rout))
.meas TRAN Pdis PARAM PdisM1+PdisM2+PdisQ1
.meas TRAN Pmar PARAM Pout-Pdis
 ;;;;;;;;;;;;;;;;;;;;;;;;;;;
.meas TRAN Glt PARAM Vsr3/Vinr
.meas TRAN GQ1 PARAM Vsr2/Vsr1
.meas TRAN GM1 PARAM Vsr3/Vsr2
.meas TRAN GM2 PARAM Voutr/Vsr2
.meas TRAN Gp PARAM 10*log10(Pout/Pin)
.meas TRAN Gv PARAM 20*log10(Voutr/Vinr)
.meas TRAN Gi PARAM 20*log10(Ioutr/Iinr)
.meas TRAN BetaQ1 PARAM Icr/Ibr
.four {F} 4 -1 V(Vt1)
.four {F} 4 -1 V(Vt2)
.four {F} 4 -1 V(Vt3)
.four {F} 4 -1 V(Vt4)
.four {F} 4 -1 V(Vt5)
.four {F} 4 -1 V(Vs1)
.four {F} 4 -1 V(Vs2)
.four {F} 4 -1 V(Vs3)
.four {F} 4 -1 V(Vout)
;.step param F list 1.5Meg 3.7Meg 5.37Meg 7.1Meg 10.1Meg 14.1Meg 21.1Meg 28.7Meg
;.step param F list  3.7Meg 14.1Meg 28.7Meg
.param F 28.7Meg
.param S 0.0008
.param BM2 4.5
.param BM1 3.0
.param R 9K
.param Z 50
.param Vgs2 3.1
.param Vgs1 2
.param Vbe 0.7
* K1 L1 L2 1
K2 L3 L4 1
* Need 4.4Vp Input for 9W output at 100R
.include BS170.lib
* Need 0.7Vp Input at 443 R at 30 MHz
* Need 0.7Vp Input at 50R
* 1K pot +68R
* Up to 20dB of gain here.
.backanno
.end